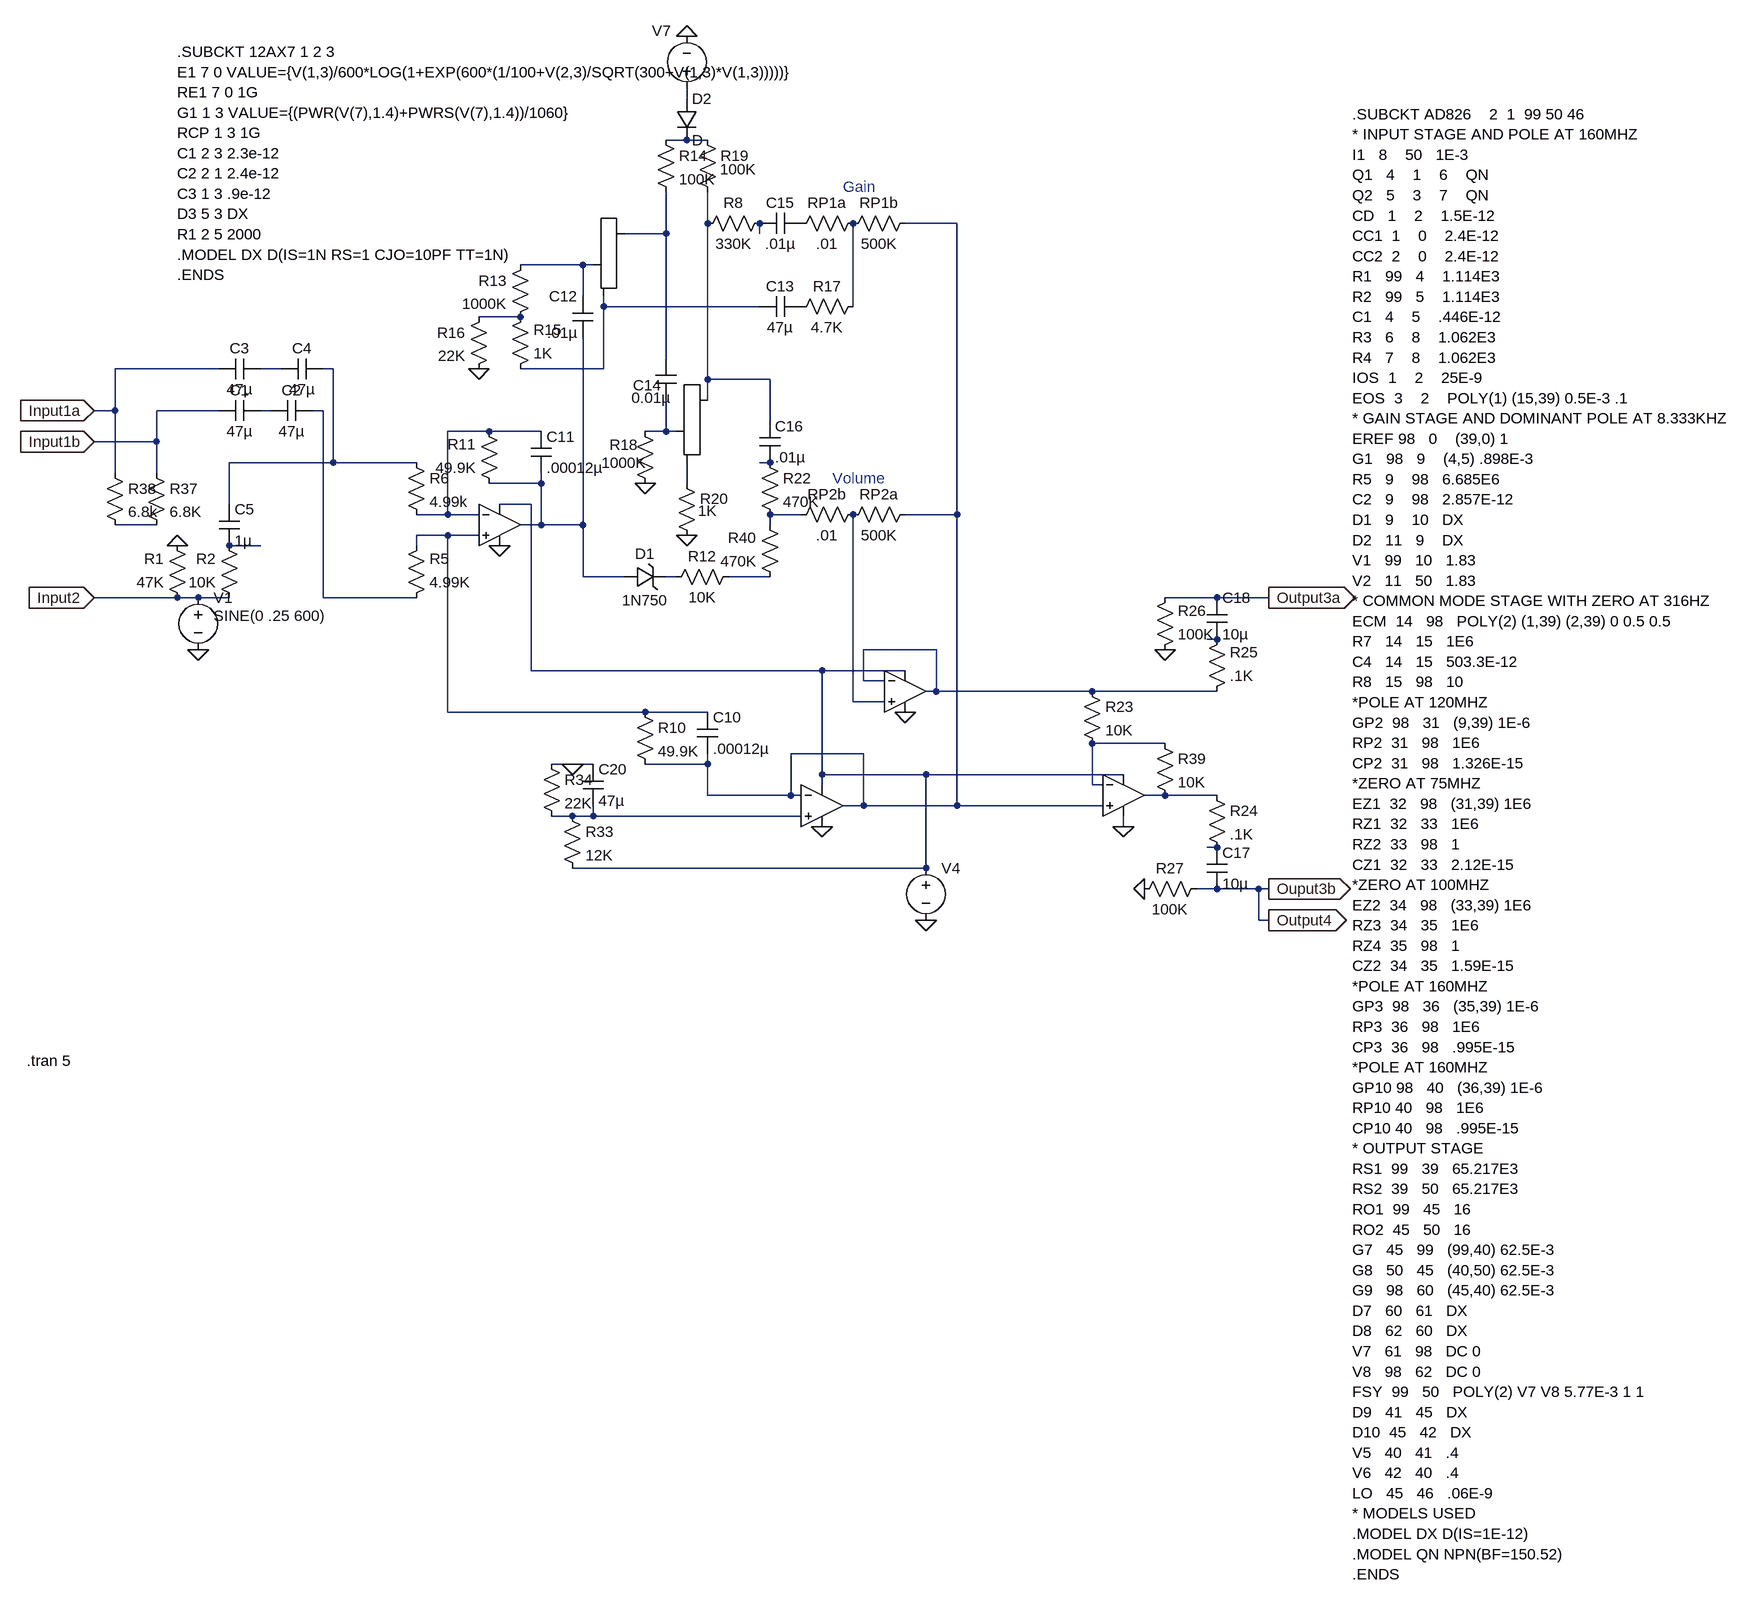
[diagram p0: schematic MP105minimal.asc]
MP105minimal.asc, the LTspice schematic file:
Version 4
SHEET 1 2332 2680
WIRE 144 624 144 608
WIRE 144 688 112 688
WIRE 176 688 144 688
WIRE 176 816 176 768
WIRE 560 816 480 816
WIRE 112 832 112 768
WIRE 112 832 48 832
WIRE 256 832 256 816
WIRE -16 880 -112 880
WIRE 0 880 -16 880
WIRE -16 928 -16 880
WIRE 16 944 16 928
WIRE 256 944 16 944
WIRE 400 944 400 816
WIRE -112 960 -176 960
WIRE 112 1024 112 832
WIRE -576 1040 -736 1040
WIRE -480 1040 -512 1040
WIRE -400 1040 -416 1040
WIRE 16 1040 16 944
WIRE 16 1040 -112 1040
WIRE 176 1056 176 816
WIRE 272 1056 176 1056
WIRE 176 1088 176 1056
WIRE -736 1104 -736 1040
WIRE -736 1104 -768 1104
WIRE -576 1104 -672 1104
WIRE -496 1104 -512 1104
WIRE -416 1104 -432 1104
WIRE 272 1120 272 1056
WIRE -160 1136 -224 1136
WIRE -80 1136 -160 1136
WIRE 112 1136 112 1088
WIRE 112 1136 80 1136
WIRE 128 1136 112 1136
WIRE -672 1152 -672 1104
WIRE -672 1152 -768 1152
WIRE -400 1184 -400 1040
WIRE -400 1184 -560 1184
WIRE -272 1184 -400 1184
WIRE 272 1184 256 1184
WIRE -736 1200 -736 1104
WIRE -672 1200 -672 1152
WIRE -80 1216 -80 1200
WIRE -80 1216 -160 1216
WIRE 144 1216 144 1184
WIRE -560 1248 -560 1184
WIRE -96 1248 -144 1248
WIRE -224 1264 -224 1136
WIRE -224 1264 -272 1264
WIRE -176 1264 -224 1264
WIRE 320 1264 272 1264
WIRE 560 1264 560 816
WIRE 560 1264 480 1264
WIRE -672 1280 -736 1280
WIRE -80 1280 -80 1216
WIRE -80 1280 -112 1280
WIRE -16 1280 -16 992
WIRE -16 1280 -80 1280
WIRE 272 1280 272 1264
WIRE -224 1296 -272 1296
WIRE -176 1296 -224 1296
WIRE -512 1312 -560 1312
WIRE -272 1312 -272 1296
WIRE -16 1360 -16 1280
WIRE 48 1360 -16 1360
WIRE 128 1360 112 1360
WIRE 272 1360 208 1360
WIRE -640 1392 -768 1392
WIRE -608 1392 -640 1392
WIRE -560 1392 -608 1392
WIRE -416 1392 -416 1104
WIRE -272 1392 -416 1392
WIRE 960 1392 880 1392
WIRE 1040 1392 960 1392
WIRE 960 1456 944 1456
WIRE 528 1472 416 1472
WIRE -96 1504 -96 1248
WIRE 352 1504 -96 1504
WIRE 480 1504 352 1504
WIRE 416 1520 416 1472
WIRE 448 1520 416 1520
WIRE 528 1536 528 1472
WIRE 528 1536 512 1536
WIRE 768 1536 528 1536
WIRE 960 1536 768 1536
WIRE 400 1552 400 1264
WIRE 448 1552 400 1552
WIRE -224 1568 -224 1296
WIRE 80 1568 -224 1568
WIRE 176 1568 80 1568
WIRE 880 1616 768 1616
WIRE 416 1632 304 1632
WIRE -32 1648 -64 1648
WIRE 0 1648 -32 1648
WIRE 176 1648 176 1632
WIRE 176 1648 80 1648
WIRE 352 1664 352 1504
WIRE 512 1664 352 1664
WIRE 816 1664 512 1664
WIRE 352 1680 352 1664
WIRE 768 1680 768 1616
WIRE 784 1680 768 1680
WIRE 176 1696 176 1648
WIRE 304 1696 304 1632
WIRE 304 1696 176 1696
WIRE 320 1696 304 1696
WIRE 880 1696 848 1696
WIRE 960 1696 880 1696
WIRE 416 1712 416 1632
WIRE 416 1712 384 1712
WIRE 560 1712 560 1264
WIRE 560 1712 416 1712
WIRE 784 1712 560 1712
WIRE -32 1728 -64 1728
WIRE 0 1728 0 1712
WIRE 0 1728 -32 1728
WIRE 320 1728 0 1728
WIRE 816 1744 816 1728
WIRE 960 1776 944 1776
WIRE 512 1808 512 1664
WIRE 512 1808 -32 1808
WIRE 960 1840 928 1840
WIRE 1024 1840 960 1840
WIRE 1040 1840 1024 1840
WIRE 1024 1888 1024 1840
WIRE 1040 1888 1024 1888
FLAG 1040 1392 Output3a
IOPIN 1040 1392 Out
FLAG 1040 1840 Ouput3b
IOPIN 1040 1840 Out
FLAG 1040 1888 Output4
IOPIN 1040 1888 Out
FLAG -768 1392 Input2
IOPIN -768 1392 In
FLAG -768 1104 Input1a
IOPIN -768 1104 In
FLAG -768 1152 Input1b
IOPIN -768 1152 In
FLAG 512 1888 0
FLAG -640 1312 0
FLAG -32 1648 0
FLAG 352 1744 0
FLAG 816 1744 0
FLAG 848 1840 0
FLAG 880 1472 0
FLAG 480 1568 0
FLAG -144 1312 0
FLAG 80 1216 0
FLAG 144 528 0
FLAG -608 1472 0
FLAG 144 1296 0
FLAG -176 1040 0
SYMBOL res 160 672 R0
WINDOW 3 35 61 Left 0
SYMATTR Value 100K
SYMATTR InstName R19
SYMBOL res 96 672 R0
SYMATTR InstName R14
SYMATTR Value 100K
SYMBOL res 160 832 R270
WINDOW 3 0 56 VBottom 0
WINDOW 0 32 56 VTop 0
SYMATTR Value 330K
SYMATTR InstName R8
SYMBOL res 288 1376 R180
WINDOW 0 36 76 Left 0
WINDOW 3 36 40 Left 0
SYMATTR InstName R40
SYMATTR Value 470K
SYMBOL res 416 928 R90
WINDOW 0 0 56 VBottom 0
WINDOW 3 32 56 VTop 0
SYMATTR InstName R17
SYMATTR Value 4.7K
SYMBOL cap 320 928 R90
WINDOW 0 0 32 VBottom 0
WINDOW 3 32 32 VTop 0
SYMATTR InstName C13
SYMATTR Value 47µ
SYMATTR SpiceLine V=63 Rser=0 Rpar=0
SYMBOL res -128 1056 M180
WINDOW 0 36 76 Left 0
WINDOW 3 36 40 Left 0
SYMATTR InstName R15
SYMATTR Value 1K
SYMBOL res -160 944 M0
SYMATTR InstName R16
SYMATTR Value 22K
SYMBOL res -96 864 M0
SYMATTR InstName R13
SYMATTR Value 1000K
SYMBOL cap 0 992 R180
WINDOW 0 24 64 Left 0
WINDOW 3 24 8 Left 0
SYMATTR InstName C12
SYMATTR Value .01µ
SYMATTR SpiceLine Rser=0 Rpar=0
SYMBOL res 112 1376 R270
WINDOW 0 32 56 VTop 0
WINDOW 3 0 56 VBottom 0
SYMATTR InstName R12
SYMATTR Value 10K
SYMBOL res 128 1200 R0
WINDOW 3 33 58 Left 0
SYMATTR Value 1K
SYMATTR InstName R20
SYMBOL res 64 1120 R0
WINDOW 0 -39 37 Left 0
WINDOW 3 -51 64 Left 0
SYMATTR InstName R18
SYMATTR Value 1000K
SYMBOL cap 96 1024 R0
WINDOW 3 -37 60 Left 0
WINDOW 0 -35 41 Left 0
SYMATTR Value 0.01µ
SYMATTR InstName C14
SYMBOL res -144 1232 R180
WINDOW 0 36 76 Left 0
WINDOW 3 36 40 Left 0
SYMATTR InstName R11
SYMATTR Value 49.9K
SYMBOL cap -96 1136 R0
SYMATTR InstName C11
SYMATTR Value .00012µ
SYMATTR SpiceLine Rser=0 Rpar=0
SYMBOL res -288 1168 R0
SYMATTR InstName R6
SYMATTR Value 4.99k
SYMBOL cap -576 1248 R0
SYMATTR InstName C5
SYMATTR Value 1µ
SYMATTR SpiceLine Rser=0 Rpar=0
SYMBOL res -544 1408 R180
WINDOW 0 36 76 Left 0
WINDOW 3 36 40 Left 0
SYMATTR InstName R2
SYMATTR Value 10K
SYMBOL res -624 1408 R180
WINDOW 0 36 76 Left 0
WINDOW 3 36 40 Left 0
SYMATTR InstName R1
SYMATTR Value 47K
SYMBOL cap -416 1024 R90
WINDOW 0 0 32 VBottom 0
WINDOW 3 32 32 VTop 0
SYMATTR InstName C4
SYMATTR Value 47µ
SYMATTR SpiceLine V=63 Rser=0 Rpar=0
SYMBOL cap -512 1024 R90
WINDOW 0 0 32 VBottom 0
WINDOW 3 32 32 VTop 0
SYMATTR InstName C3
SYMATTR Value 47µ
SYMATTR SpiceLine V=63v Rser=0 Rpar=0
SYMBOL cap -432 1088 R90
WINDOW 0 0 32 VBottom 0
WINDOW 3 32 32 VTop 0
SYMATTR InstName C2
SYMATTR Value 47µ
SYMATTR SpiceLine V=63 Rser=0 Rpar=0
SYMBOL cap -512 1088 R90
WINDOW 0 0 32 VBottom 0
WINDOW 3 32 32 VTop 0
SYMATTR InstName C1
SYMATTR Value 47µ
SYMATTR SpiceLine V=63 Rser=0 Rpar=0
SYMBOL res -752 1184 R0
SYMATTR InstName R38
SYMATTR Value 6.8k
SYMBOL res -688 1184 R0
SYMATTR InstName R37
SYMATTR Value 6.8K
SYMBOL res -288 1408 M180
WINDOW 0 36 76 Left 0
WINDOW 3 36 40 Left 0
SYMATTR InstName R5
SYMATTR Value 4.99K
SYMBOL res 64 1552 R0
SYMATTR InstName R10
SYMATTR Value 49.9K
SYMBOL cap 160 1568 R0
SYMATTR InstName C10
SYMATTR Value .00012µ
SYMATTR SpiceLine Rser=0 Rpar=0
SYMBOL cap -16 1648 R0
SYMATTR InstName C20
SYMATTR Value 47µ
SYMATTR SpiceLine Rser=0 Rpar=0
SYMBOL res -80 1632 R0
SYMATTR InstName R34
SYMATTR Value 22K
SYMBOL res -48 1712 R0
SYMATTR InstName R33
SYMATTR Value 12K
SYMBOL res 752 1520 R0
SYMATTR InstName R23
SYMATTR Value 10K
SYMBOL res 864 1600 R0
SYMATTR InstName R39
SYMATTR Value 10K
SYMBOL res 944 1680 R0
SYMATTR InstName R24
SYMATTR Value .1K
SYMBOL res 944 1552 M180
WINDOW 0 36 76 Left 0
WINDOW 3 36 40 Left 0
SYMATTR InstName R25
SYMATTR Value .1K
SYMBOL cap 944 1456 M180
WINDOW 0 24 64 Left 0
WINDOW 3 24 8 Left 0
SYMATTR InstName C18
SYMATTR Value 10µ
SYMATTR SpiceLine Rser=0 Rpar=0
SYMBOL cap 944 1776 R0
SYMATTR InstName C17
SYMATTR Value 10µ
SYMATTR SpiceLine Rser=0 Rpar=0
SYMBOL res 832 1856 R270
WINDOW 0 32 56 VTop 0
WINDOW 3 0 56 VBottom 0
SYMATTR InstName R27
SYMATTR Value 100K
SYMBOL res 864 1488 M180
WINDOW 0 36 76 Left 0
WINDOW 3 36 40 Left 0
SYMATTR InstName R26
SYMATTR Value 100K
SYMBOL voltage 512 1792 R0
WINDOW 3 24 104 Invisible 0
WINDOW 123 0 0 Left 0
WINDOW 39 0 0 Left 0
SYMATTR Value 12
SYMATTR InstName V4
SYMBOL voltage 144 624 R180
WINDOW 0 24 104 Left 0
WINDOW 3 24 16 Invisible 0
WINDOW 123 0 0 Left 0
WINDOW 39 0 0 Left 0
SYMATTR InstName V7
SYMATTR Value 92
SYMBOL voltage -608 1376 R0
WINDOW 39 0 0 Left 0
WINDOW 3 24 44 Left 0
SYMATTR Value2 AC 1
SYMATTR InstName V1
SYMATTR Value SINE(0 .25 600)
SYMBOL res 304 832 R270
WINDOW 0 32 56 VTop 0
WINDOW 3 0 56 VBottom 0
SYMATTR InstName RP1a
SYMATTR Value .01
SYMBOL res 384 832 R270
WINDOW 0 32 56 VTop 0
WINDOW 3 0 56 VBottom 0
SYMATTR InstName RP1b
SYMATTR Value 500K
SYMBOL res 496 1248 R90
WINDOW 0 0 56 VBottom 0
WINDOW 3 32 56 VTop 0
SYMATTR InstName RP2a
SYMATTR Value 500K
SYMBOL res 304 1280 R270
WINDOW 0 32 56 VTop 0
WINDOW 3 0 56 VBottom 0
SYMATTR InstName RP2b
SYMATTR Value .01
SYMBOL Misc\\triode 48 880 R0
WINDOW 0 8 -64 Invisible 0
WINDOW 3 -24 64 Invisible 0
SYMATTR InstName U1
SYMATTR Value 12AX7
SYMATTR Value2 12AX7
SYMBOL Misc\\triode 176 1136 R0
WINDOW 0 8 -64 Invisible 0
WINDOW 3 -24 64 Invisible 0
SYMATTR InstName U2
SYMATTR Value 12AX7
SYMATTR Value2 12AX7
SYMBOL diode 128 624 R0
SYMATTR InstName D2
SYMBOL cap 256 832 R270
WINDOW 0 32 32 VTop 0
WINDOW 3 0 32 VBottom 0
SYMATTR InstName C15
SYMATTR Value .01µ
SYMBOL res 256 1168 R0
SYMATTR InstName R22
SYMATTR Value 470K
SYMBOL cap 256 1120 R0
SYMATTR InstName C16
SYMATTR Value .01µ
SYMATTR SpiceLine Rser=0 Rpar=0
SYMBOL Opamps\\opamp2 -144 1216 R0
WINDOW 0 16 32 Invisible 0
WINDOW 3 16 96 Invisible 0
SYMATTR InstName U3
SYMATTR Value ad826
SYMATTR Value2 ad826
SYMBOL Opamps\\opamp2 352 1648 R0
WINDOW 0 16 32 Invisible 0
WINDOW 3 16 96 Invisible 0
SYMATTR InstName U4
SYMATTR Value ad826
SYMATTR Value2 ad826
SYMBOL Opamps\\opamp2 480 1472 R0
WINDOW 0 16 32 Invisible 0
WINDOW 3 16 96 Invisible 0
SYMATTR InstName U5
SYMATTR Value ad826
SYMATTR Value2 ad826
SYMBOL Opamps\\opamp2 816 1632 R0
WINDOW 0 16 32 Invisible 0
WINDOW 3 16 96 Invisible 0
SYMATTR InstName U6
SYMATTR Value ad826
SYMATTR Value2 ad826
SYMBOL zener 48 1376 R270
WINDOW 0 36 32 VTop 0
WINDOW 3 -4 32 VBottom 0
SYMATTR InstName D1
SYMATTR Value 1N750
SYMATTR Description Diode
SYMATTR Type diode
TEXT 1168 648 Left 0 !.SUBCKT AD826    2  1  99 50 46\n* INPUT STAGE AND POLE AT 160MHZ\nI1   8    50   1E-3\nQ1   4    1    6    QN\nQ2   5    3    7    QN\nCD   1    2    1.5E-12\nCC1  1    0    2.4E-12\nCC2  2    0    2.4E-12\nR1   99   4    1.114E3\nR2   99   5    1.114E3\nC1   4    5    .446E-12\nR3   6    8    1.062E3\nR4   7    8    1.062E3\nIOS  1    2    25E-9\nEOS  3    2    POLY(1) (15,39) 0.5E-3 .1\n* GAIN STAGE AND DOMINANT POLE AT 8.333KHZ\nEREF 98   0    (39,0) 1\nG1   98   9    (4,5) .898E-3\nR5   9    98   6.685E6\nC2   9    98   2.857E-12\nD1   9    10   DX\nD2   11   9    DX\nV1   99   10   1.83\nV2   11   50   1.83\n* COMMON MODE STAGE WITH ZERO AT 316HZ\nECM  14   98   POLY(2) (1,39) (2,39) 0 0.5 0.5\nR7   14   15   1E6\nC4   14   15   503.3E-12\nR8   15   98   10\n*POLE AT 120MHZ\nGP2  98   31   (9,39) 1E-6\nRP2  31   98   1E6\nCP2  31   98   1.326E-15\n*ZERO AT 75MHZ\nEZ1  32   98   (31,39) 1E6\nRZ1  32   33   1E6   \nRZ2  33   98   1\nCZ1  32   33   2.12E-15\n*ZERO AT 100MHZ\nEZ2  34   98   (33,39) 1E6\nRZ3  34   35   1E6\nRZ4  35   98   1\nCZ2  34   35   1.59E-15\n*POLE AT 160MHZ\nGP3  98   36   (35,39) 1E-6\nRP3  36   98   1E6\nCP3  36   98   .995E-15\n*POLE AT 160MHZ\nGP10 98   40   (36,39) 1E-6\nRP10 40   98   1E6\nCP10 40   98   .995E-15\n* OUTPUT STAGE\nRS1  99   39   65.217E3\nRS2  39   50   65.217E3\nRO1  99   45   16\nRO2  45   50   16\nG7   45   99   (99,40) 62.5E-3\nG8   50   45   (40,50) 62.5E-3\nG9   98   60   (45,40) 62.5E-3\nD7   60   61   DX\nD8   62   60   DX\nV7   61   98   DC 0\nV8   98   62   DC 0\nFSY  99   50   POLY(2) V7 V8 5.77E-3 1 1\nD9   41   45   DX\nD10  45   42   DX\nV5   40   41   .4\nV6   42   40   .4\nLO   45   46   .06E-9\n* MODELS USED\n.MODEL DX D(IS=1E-12)\n.MODEL QN NPN(BF=150.52)\n.ENDS
TEXT -640 552 Left 0 !.SUBCKT 12AX7 1 2 3\nE1 7 0 VALUE={V(1,3)/600*LOG(1+EXP(600*(1/100+V(2,3)/SQRT(300+V(1,3)*V(1,3)))))}\nRE1 7 0 1G\nG1 1 3 VALUE={(PWR(V(7),1.4)+PWRS(V(7),1.4))/1060}\nRCP 1 3 1G \nC1 2 3 2.3e-12\nC2 2 1 2.4e-12\nC3 1 3 .9e-12\nD3 5 3 DX\nR1 2 5 2000\n.MODEL DX D(IS=1N RS=1 CJO=10PF TT=1N)\n.ENDS
TEXT -872 2104 Left 0 !.tran 5
TEXT 384 760 Left 0 ;Gain
TEXT 368 1208 Left 0 ;Volume

The netlist it stands for:
* MP105minimal.asc
R19 N002 N003 100K
R14 N002 N005 100K
R8 N003 N006 330K
R40 N026 N021 470K
R17 N009 P001 4.7K
C13 P001 N008 47µ V=63 Rser=0 Rpar=0
R15 N008 N010 1K
R16 N010 0 22K
R13 N007 N010 1000K
C12 N018 N007 .01µ Rser=0 Rpar=0
R12 N025 N026 10K
R20 N019 0 1K
R18 N016 0 1000K
C14 N005 N016 0.01µ
R11 N018 N015 49.9K
C11 N015 N018 .00012µ Rser=0 Rpar=0
R6 N012 N015 4.99k
C5 N012 N024 1µ Rser=0 Rpar=0
R2 Input2 N024 10K
R1 Input2 0 47K
C4 N012 N011 47µ V=63 Rser=0 Rpar=0
C3 N011 Input1a 47µ V=63v Rser=0 Rpar=0
C2 N014 N013 47µ V=63 Rser=0 Rpar=0
C1 N013 Input1b 47µ V=63 Rser=0 Rpar=0
R38 Input1a N022 6.8k
R37 Input1b N022 6.8K
R5 N014 N023 4.99K
R10 N023 N004 49.9K
C10 N023 N004 .00012µ Rser=0 Rpar=0
C20 0 N032 47µ Rser=0 Rpar=0
R34 0 N032 22K
R33 N032 N020 12K
R23 N028 N030 10K
R39 N030 N031 10K
R24 N031 N033 .1K
R25 N028 N027 .1K
C18 N027 Output3a 10µ Rser=0 Rpar=0
C17 N033 Output4 10µ Rser=0 Rpar=0
R27 0 Output4 100K
R26 0 Output3a 100K
V4 N020 0 12
V7 N001 0 92
V1 Input2 0 SINE(0 .25 600) AC 1
RP1a P002 N009 .01
RP1b N009 N004 500K
RP2a N004 N029 500K
RP2b N021 N029 .01
XU1 N005 N007 N008 12AX7 12AX7
XU2 N003 N016 N019 12AX7 12AX7
D2 N001 N002 D
C15 N006 P002 .01µ
R22 N017 N021 470K
C16 N003 N017 .01µ Rser=0 Rpar=0
XU3 N023 N015 N020 0 N018 ad826 ad826  ; pins In+ In- V+ V- OUT
XU4 N032 N004 N020 0 N004 ad826 ad826  ; pins In+ In- V+ V- OUT
XU5 N029 N028 N020 0 N028 ad826 ad826  ; pins In+ In- V+ V- OUT
XU6 N004 N030 N020 0 N031 ad826 ad826  ; pins In+ In- V+ V- OUT
D1 N018 N025 1N750
.model D D
.lib standard.dio
.SUBCKT AD826    2  1  99 50 46
* INPUT STAGE AND POLE AT 160MHZ
I1   8    50   1E-3
Q1   4    1    6    QN
Q2   5    3    7    QN
CD   1    2    1.5E-12
CC1  1    0    2.4E-12
CC2  2    0    2.4E-12
R1   99   4    1.114E3
R2   99   5    1.114E3
C1   4    5    .446E-12
R3   6    8    1.062E3
R4   7    8    1.062E3
IOS  1    2    25E-9
EOS  3    2    POLY(1) (15,39) 0.5E-3 .1
* GAIN STAGE AND DOMINANT POLE AT 8.333KHZ
EREF 98   0    (39,0) 1
G1   98   9    (4,5) .898E-3
R5   9    98   6.685E6
C2   9    98   2.857E-12
D1   9    10   DX
D2   11   9    DX
V1   99   10   1.83
V2   11   50   1.83
* COMMON MODE STAGE WITH ZERO AT 316HZ
ECM  14   98   POLY(2) (1,39) (2,39) 0 0.5 0.5
R7   14   15   1E6
C4   14   15   503.3E-12
R8   15   98   10
*POLE AT 120MHZ
GP2  98   31   (9,39) 1E-6
RP2  31   98   1E6
CP2  31   98   1.326E-15
*ZERO AT 75MHZ
EZ1  32   98   (31,39) 1E6
RZ1  32   33   1E6
RZ2  33   98   1
CZ1  32   33   2.12E-15
*ZERO AT 100MHZ
EZ2  34   98   (33,39) 1E6
RZ3  34   35   1E6
RZ4  35   98   1
CZ2  34   35   1.59E-15
*POLE AT 160MHZ
GP3  98   36   (35,39) 1E-6
RP3  36   98   1E6
CP3  36   98   .995E-15
*POLE AT 160MHZ
GP10 98   40   (36,39) 1E-6
RP10 40   98   1E6
CP10 40   98   .995E-15
* OUTPUT STAGE
RS1  99   39   65.217E3
RS2  39   50   65.217E3
RO1  99   45   16
RO2  45   50   16
G7   45   99   (99,40) 62.5E-3
G8   50   45   (40,50) 62.5E-3
G9   98   60   (45,40) 62.5E-3
D7   60   61   DX
D8   62   60   DX
V7   61   98   DC 0
V8   98   62   DC 0
FSY  99   50   POLY(2) V7 V8 5.77E-3 1 1
D9   41   45   DX
D10  45   42   DX
V5   40   41   .4
V6   42   40   .4
LO   45   46   .06E-9
* MODELS USED
.MODEL DX D(IS=1E-12)
.MODEL QN NPN(BF=150.52)
.ENDS
.SUBCKT 12AX7 1 2 3
E1 7 0 VALUE={V(1,3)/600*LOG(1+EXP(600*(1/100+V(2,3)/SQRT(300+V(1,3)*V(1,3)))))}
RE1 7 0 1G
G1 1 3 VALUE={(PWR(V(7),1.4)+PWRS(V(7),1.4))/1060}
RCP 1 3 1G
C1 2 3 2.3e-12
C2 2 1 2.4e-12
C3 1 3 .9e-12
D3 5 3 DX
R1 2 5 2000
.MODEL DX D(IS=1N RS=1 CJO=10PF TT=1N)
.ENDS
.tran 5
* Gain
* Volume
.backanno
.end